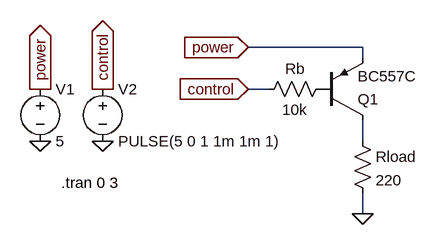
[diagram p0: schematic switch-pnp.asc]
switch-pnp.asc, the LTspice schematic file:
Version 4
SHEET 1 880 680
WIRE 240 80 64 80
WIRE 240 96 240 80
WIRE 96 144 64 144
WIRE 240 224 240 192
WIRE 240 336 240 304
FLAG 240 336 0
FLAG 64 144 control
IOPIN 64 144 In
FLAG 64 80 power
IOPIN 64 80 In
FLAG -256 224 0
FLAG -256 144 power
IOPIN -256 144 Out
FLAG -160 224 0
FLAG -160 144 control
IOPIN -160 144 Out
SYMBOL Res 224 208 R0
SYMATTR InstName Rload
SYMATTR Value 220
SYMBOL Res 192 128 R90
WINDOW 0 0 56 VBottom 2
WINDOW 3 32 56 VTop 2
SYMATTR InstName Rb
SYMATTR Value 10k
SYMBOL Voltage -256 128 R0
SYMATTR InstName V1
SYMATTR Value 5
SYMBOL Voltage -160 128 R0
SYMATTR InstName V2
SYMATTR Value PULSE(5 0 1 1m 1m 1)
SYMBOL pnp 176 192 M180
SYMATTR InstName Q1
SYMATTR Value BC557C
TEXT -224 288 Left 2 !.tran 0 3

The netlist it stands for:
* switch-pnp.asc
Rload N001 0 220
Rb P001 control 10k
V1 power 0 5
V2 control 0 PULSE(5 0 1 1m 1m 1)
Q1 N001 P001 power 0 BC557C
.model NPN NPN
.model PNP PNP
.lib standard.bjt
.tran 0 3
.backanno
.end